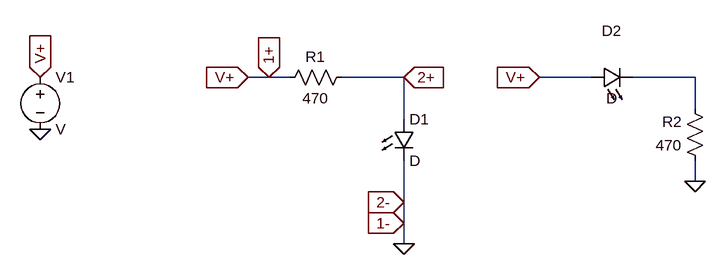
[diagram p0: schematic ohm_law.asc]
ohm_law.asc, the LTspice schematic file:
Version 4
SHEET 1 880 680
WIRE 48 80 16 80
WIRE 80 80 48 80
WIRE 256 80 160 80
WIRE 544 80 464 80
WIRE 704 80 608 80
WIRE 704 128 704 80
WIRE 256 144 256 80
WIRE 704 240 704 208
WIRE 256 272 256 208
WIRE 256 304 256 272
WIRE 256 336 256 304
FLAG 256 336 0
FLAG 16 80 V+
IOPIN 16 80 In
FLAG -304 80 V+
IOPIN -304 80 In
FLAG -304 160 0
FLAG 704 240 0
FLAG 464 80 V+
IOPIN 464 80 In
FLAG 48 80 1+
IOPIN 48 80 In
FLAG 256 80 2+
IOPIN 256 80 In
FLAG 256 272 2-
IOPIN 256 272 In
FLAG 256 304 1-
IOPIN 256 304 In
SYMBOL res 176 64 R90
WINDOW 0 0 56 VBottom 2
WINDOW 3 32 56 VTop 2
SYMATTR InstName R1
SYMATTR Value 470
SYMBOL LED 240 144 R0
SYMATTR InstName D1
SYMBOL voltage -304 64 R0
SYMATTR InstName V1
SYMBOL res 720 224 R180
WINDOW 0 36 76 Left 2
WINDOW 3 36 40 Left 2
SYMATTR InstName R2
SYMATTR Value 470
SYMBOL LED 544 96 R270
WINDOW 0 72 32 VTop 2
WINDOW 3 0 32 VBottom 2
SYMATTR InstName D2

The netlist it stands for:
* ohm_law.asc
R1 2+ 1+ 470
D1 2+ 0 D
V1 1+ 0 V
R2 0 N001 470
D2 1+ N001 D
.model D D
.lib standard.dio
.backanno
.end